# Altium project PCB_Project_1.PrjPcb
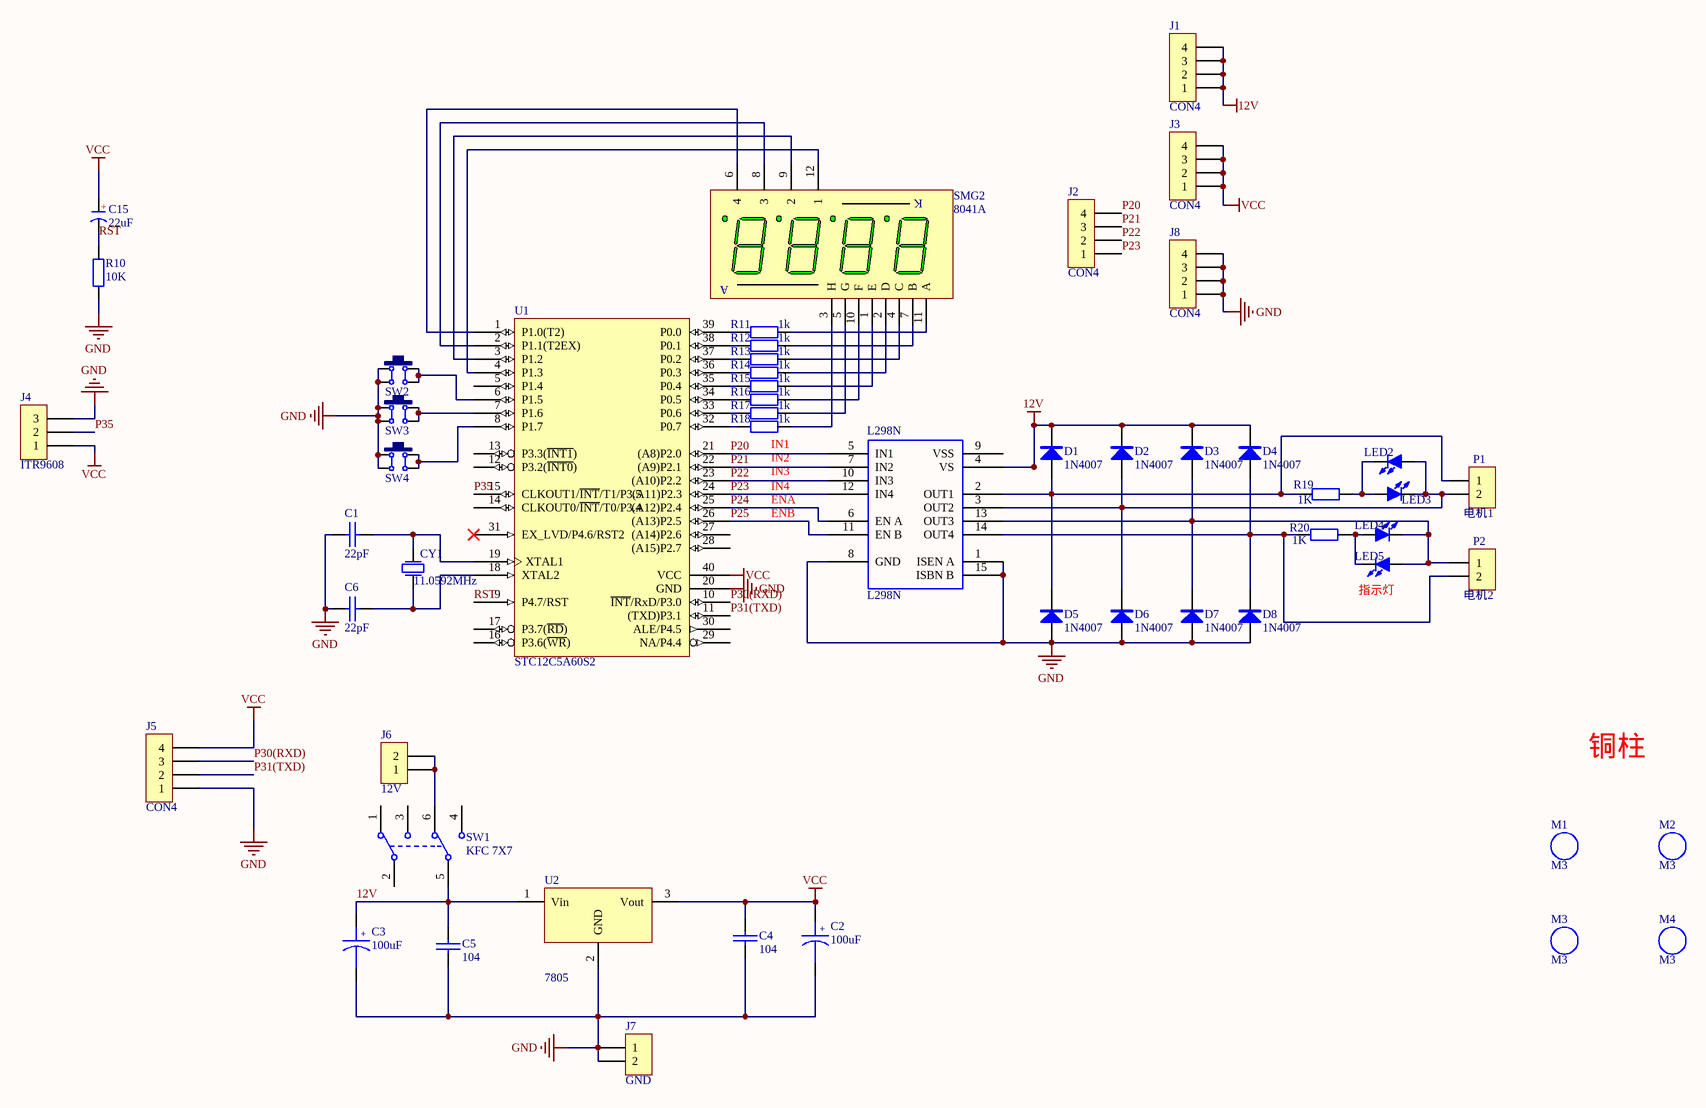
[diagram p0: Sheet1.SchDoc]
1 sheet, 53 parts. Net scope: global (net labels, ports and power ports of the same name join across sheets).
Board file: PCB1.PcbDoc

## Sheet Sheet1.SchDoc
size A3

### Parts
C1  22pF  [瓷片电容]
C2  100uF  [CAP 2.5*5*11]
C3  100uF  [CAP 2.5*5*11]
C4  104  [C 0805_M]
C5  104  [C 0805_M]
C6  22pF  [瓷片电容]
C15  22uF  [CAP 2.5*5*11]
CY1  11.0592MHz  [XTAL-1]
D1  1N4007  [SOD-123]
D2  1N4007  [SOD-123]
D3  1N4007  [SOD-123]
D4  1N4007  [SOD-123]
D5  1N4007  [SOD-123]
D6  1N4007  [SOD-123]
D7  1N4007  [SOD-123]
D8  1N4007  [SOD-123]
J1  CON4  [SIP4]
J2  CON4  [SIP4]
J3  CON4  [SIP4]
J4  ITR9608  [SIP3]
J5  CON4  [SIP4]
J6  12V  [SIP2]
J7  GND  [SIP2]
J8  CON4  [SIP4]
L298N  L298N  [L298N散热片]
LED2  红色  [LED 3MM-B]  (value not drawn)
LED3  红色  [LED 3MM-B]  (value not drawn)
LED4  红色  [LED 3MM-B]  (value not drawn)
LED5  红色  [LED 3MM-B]  (value not drawn)
M1  M3  [M3x4+6_L]
M2  M3  [M3x4+6_L]
M3  M3  [M3x4+6_L]
M4  M3  [M3x4+6_L]
P1  电机1  [HDR2.54-LI-2P]
P2  电机2  [HDR2.54-LI-2P]
R10  10K  [R 0805_M]
R11  1k  [RS 1/2W]
R12  1k  [RS 1/2W]
R13  1k  [RS 1/2W]
R14  1k  [RS 1/2W]
R15  1k  [RS 1/2W]
R16  1k  [RS 1/2W]
R17  1k  [RS 1/2W]
R18  1k  [RS 1/2W]
R19  1K  [R 0805_M]
R20  1K  [R 0805_M]
SMG2  8041A  [SMG 0.39-4P_A]
SW1  KFC 7X7  [KFC DIP-7X7]
SW2  6x6x5  [TSW DIP-6*6*6]  (value not drawn)
SW3  6x6x5  [TSW DIP-6*6*6]  (value not drawn)
SW4  6x6x5  [TSW DIP-6*6*6]  (value not drawn)
U1  STC12C5A60S2  [DIP40-600]
U2  7805  [TO126]

### Nets
12V: C3.1 C5.1 D1.2(K) D2.2(K) D3.2(K) D4.2(K) J1.1 J1.2 J1.3 J1.4 L298N.4(VS) SW1.5(COM2) U2.1(Vin)
GND: C1.1 C2.2 C3.2 C4.2 C5.2 C6.1 D5.1(A) D6.1(A) D7.1(A) D8.1(A) J4.3 J5.1 J7.1 J7.2 J8.1 J8.2 J8.3 J8.4 L298N.1(ISEN_A) L298N.8(GND) L298N.15(ISBN_B) R10.2 SW2.1 SW2.4 SW3.1 SW3.4 SW4.1 SW4.4 U1.20(GND) U2.2(GND)
VCC: C2.1 C4.1 C15.1(A) J3.1 J3.2 J3.3 J3.4 J4.1 J5.4 U1.40(VCC) U2.3(Vout)
P20: J2.4 L298N.5(IN1) U1.21((A8)P2.0)
P21: J2.3 L298N.7(IN2) U1.22((A9)P2.1)
P22: J2.2 L298N.10(IN3) U1.23((A10)P2.2)
P23: J2.1 L298N.12(IN4) U1.24((A11)P2.3)
P24: L298N.6(EN_A) U1.25((A12)P2.4)
P25: L298N.11(EN_B) U1.26((A13)P2.5)
P30(RXD): J5.3 U1.10(~{INT}/RxD/P3.0)
P31(TXD): J5.2 U1.11((TXD)P3.1)
P35: J4.2 U1.15(CLKOUT1/~{INT}/T1/P3.5)
RST: C15.2(K) R10.1 U1.9(P4.7/RST)
NetC1_2: C1.2 CY1.1(P1) U1.19(XTAL1)
NetC6_2: C6.2 CY1.2(P2) U1.18(XTAL2)
NetD1_1: D1.1(A) D5.2(K) L298N.2(OUT1) P1.1 R19.2
NetD2_1: D2.1(A) D6.2(K) L298N.3(OUT2) LED2.1(A) LED3.2(K) P1.2
NetD3_1: D3.1(A) D7.2(K) L298N.13(OUT3) LED4.2(K) LED5.1(A) P2.1
NetD4_1: D4.1(A) D8.2(K) L298N.14(OUT4) P2.2 R20.2
NetJ6_1: J6.1 J6.2 SW1.6(NC2)
NetLED2_2: LED2.2(K) LED3.1(A) R19.1
NetLED4_1: LED4.1(A) LED5.2(K) R20.1
NetR11_1: R11.1 SMG2.11(A)
NetR11_2: R11.2 U1.39(P0.0)
NetR12_1: R12.1 SMG2.7(B)
NetR12_2: R12.2 U1.38(P0.1)
NetR13_1: R13.1 SMG2.4(C)
NetR13_2: R13.2 U1.37(P0.2)
NetR14_1: R14.1 SMG2.2(D)
NetR14_2: R14.2 U1.36(P0.3)
NetR15_1: R15.1 SMG2.1(E)
NetR15_2: R15.2 U1.35(P0.4)
NetR16_1: R16.1 SMG2.10(F)
NetR16_2: R16.2 U1.34(P0.5)
NetR17_1: R17.1 SMG2.5(G)
NetR17_2: R17.2 U1.33(P0.6)
NetR18_1: R18.1 SMG2.3(H)
NetR18_2: R18.2 U1.32(P0.7)
NetSMG2_6: SMG2.6(4) U1.1(P1.0(T2))
NetSMG2_8: SMG2.8(3) U1.2(P1.1(T2EX))
NetSMG2_9: SMG2.9(2) U1.3(P1.2)
NetSMG2_12: SMG2.12(1) U1.4(P1.3)
NetSW2_2: SW2.2 SW2.3 U1.6(P1.5)
NetSW3_2: SW3.2 SW3.3 U1.7(P1.6)
NetSW4_2: SW4.2 SW4.3 U1.8(P1.7)

Not connected (* = marked no-connect by the designer): L298N 9(VSS); SW1 1(NC1) 2(COM2) 3(NO1) 4(NO2); U1 5(P1.4) 12(P3.2(~{INT0})) 13(P3.3(~{INT1})) 14(CLKOUT0/~{INT}/T0/P3.4) 16(P3.6(~{WR})) 17(P3.7(~{RD})) 27((A14)P2.6) 28((A15)P2.7) 29(NA/P4.4) 30(ALE/P4.5) 31(EX_LVD/P4.6/RST2)*

### Notes on the sheet
- (near R18) IN1
- ENA
- IN4
- IN3
- IN2
- ENB
- (near LED5) 指示灯
- 铜柱
- (in symbol 8041A) K
- (in symbol C-CS) +
- (in symbol 电解电容) +

### Library data of the parts
C1 C6 = CAP1
C2 C3 = 电解电容: Capacitor
C4 C5 = 普通电容: Capacitor
C15 = C-CS: 直插固态电容; 版权归属: 源创客; BOM名称: 直插固态电容; 学习资源: www.ooocke.com
CY1 = CRY
D1-D8 = 1N4007: 整流二极管; 版权归属: 源创客; BOM名称: 整流二极管; 学习资源: www.ooocke.com
J2 J5 = CON4: Connector
J4 = CON3
J6 J7 = CON2: Connector
LED2-LED5 = LED-3MM: 插件LED; 版权归属: 源创客; BOM名称: 插件LED; 学习资源: www.ooocke.com
M1-M4 = M3: 铜柱孔; 版权归属: 源创客; BOM名称: 铜柱孔; 学习资源: www.ooocke.com
P1 P2 = Header 2: 2P接插件; 版权归属: 源创客; BOM名称: 2P接插件; 学习资源: www.ooocke.com
R10-R20 = R-CRR: 直插色环电阻; BOM名称: 色环电阻; 版权归属: 源创客; 学习资源: www.ooocke.com
SMG2 = 8041A: 0.8寸4位共阴数码管; 版权归属: 源创客; BOM名称: 0.8寸4位共阴; 学习资源: www.ooocke.com
SW1 = KFC 7X7: 7*7自锁开关; 版权归属: 源创客; BOM名称: 7*7自锁开关; 学习资源: www.ooocke.com
SW2-SW4 = TSW DIP-6x6: 直插6x6轻触开关; 版权归属: 源创客; BOM名称: 直插6x6轻触开关; 学习资源: www.ooocke.com
U1 = AT89C51RC: 8-Bit Microcontroller with 32K Flash ROM